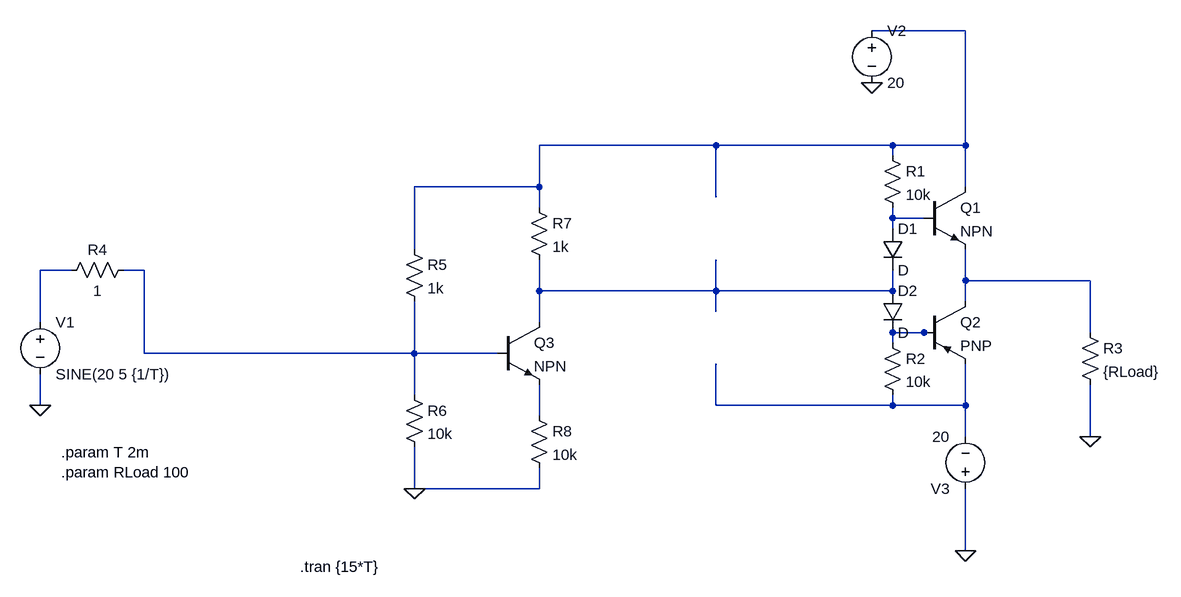
[diagram p0: schematic emalneualGegentakt.asc]
emalneualGegentakt.asc, the LTspice schematic file:
Version 4
SHEET 1 880 680
WIRE 480 -256 336 -256
WIRE 96 -80 -176 -80
WIRE 368 -80 96 -80
WIRE 480 -80 480 -256
WIRE 480 -80 368 -80
WIRE 368 -64 368 -80
WIRE -176 -16 -176 -80
WIRE -176 -16 -368 -16
WIRE 480 -16 480 -80
WIRE 96 0 96 -80
WIRE -176 16 -176 -16
WIRE 368 32 368 16
WIRE 416 32 368 32
WIRE 368 48 368 32
WIRE -368 80 -368 -16
WIRE -896 112 -944 112
WIRE -784 112 -816 112
WIRE 480 128 480 80
WIRE 672 128 480 128
WIRE -176 144 -176 96
WIRE 96 144 96 96
WIRE 96 144 -176 144
WIRE 368 144 368 112
WIRE 368 144 96 144
WIRE 480 160 480 128
WIRE 96 176 96 144
WIRE -944 192 -944 112
WIRE -176 192 -176 144
WIRE 416 208 368 208
WIRE 432 208 416 208
WIRE 672 208 672 128
WIRE 368 224 368 208
WIRE -784 240 -784 112
WIRE -368 240 -368 160
WIRE -368 240 -784 240
WIRE -240 240 -368 240
WIRE -368 304 -368 240
WIRE -944 320 -944 272
WIRE 96 320 96 256
WIRE 368 320 368 304
WIRE 368 320 96 320
WIRE 480 320 480 256
WIRE 480 320 368 320
WIRE -176 336 -176 288
WIRE 480 368 480 320
WIRE 672 368 672 288
WIRE -368 448 -368 384
WIRE -176 448 -176 416
WIRE -176 448 -368 448
WIRE 480 544 480 448
FLAG 480 544 0
FLAG 336 -176 0
FLAG 672 368 0
FLAG -944 320 0
FLAG -368 448 0
SYMBOL voltage -944 176 R0
WINDOW 123 0 0 Left 0
WINDOW 39 0 0 Left 0
SYMATTR InstName V1
SYMATTR Value SINE(20 5 {1/T})
SYMBOL voltage 336 -272 R0
WINDOW 123 0 0 Left 0
WINDOW 39 0 0 Left 0
SYMATTR InstName V2
SYMATTR Value 20
SYMBOL npn 416 -16 R0
SYMATTR InstName Q1
SYMBOL pnp 416 160 R0
SYMATTR InstName Q2
SYMBOL diode 352 48 R0
SYMATTR InstName D1
SYMBOL diode 352 144 R0
SYMATTR InstName D2
SYMBOL res 352 -80 R0
SYMATTR InstName R1
SYMATTR Value 10k
SYMBOL res 352 208 R0
SYMATTR InstName R2
SYMATTR Value 10k
SYMBOL voltage 480 464 R180
WINDOW 123 0 0 Left 0
WINDOW 39 0 0 Left 0
SYMATTR InstName V3
SYMATTR Value 20
SYMBOL res 656 192 R0
SYMATTR InstName R3
SYMATTR Value {RLoad}
SYMBOL npn -240 192 R0
SYMATTR InstName Q3
SYMBOL res -384 64 R0
SYMATTR InstName R5
SYMATTR Value 1k
SYMBOL res -384 288 R0
SYMATTR InstName R6
SYMATTR Value 10k
SYMBOL res -192 0 R0
SYMATTR InstName R7
SYMATTR Value 1k
SYMBOL res -192 320 R0
SYMATTR InstName R8
SYMATTR Value 10k
SYMBOL res -800 96 R90
WINDOW 0 0 56 VBottom 2
WINDOW 3 32 56 VTop 2
SYMATTR InstName R4
SYMATTR Value 1
TEXT -544 568 Left 2 !.tran {15*T}
TEXT -912 392 Left 2 !.param T 2m\n.param RLoad 100

The netlist it stands for:
* emalneualGegentakt.asc
V1 N003 0 SINE(20 5 {1/T})
V2 N001 0 20
Q1 N001 N002 N005 0 NPN
Q2 N005 N007 N008 0 PNP
D1 N002 N006 D
D2 N006 N007 D
R1 N001 N002 10k
R2 N007 N008 10k
V3 0 N008 20
R3 N005 0 {RLoad}
Q3 N006 N004 N009 0 NPN
R5 N001 N004 1k
R6 N004 0 10k
R7 N001 N006 1k
R8 N009 0 10k
R4 N004 N003 1
.model D D
.lib standard.dio
.model NPN NPN
.model PNP PNP
.lib standard.bjt
.tran {15*T}
.param T 2m
.param RLoad 100
.backanno
.end